# EAGLE design Breakout (EAGLE 7.6.0)
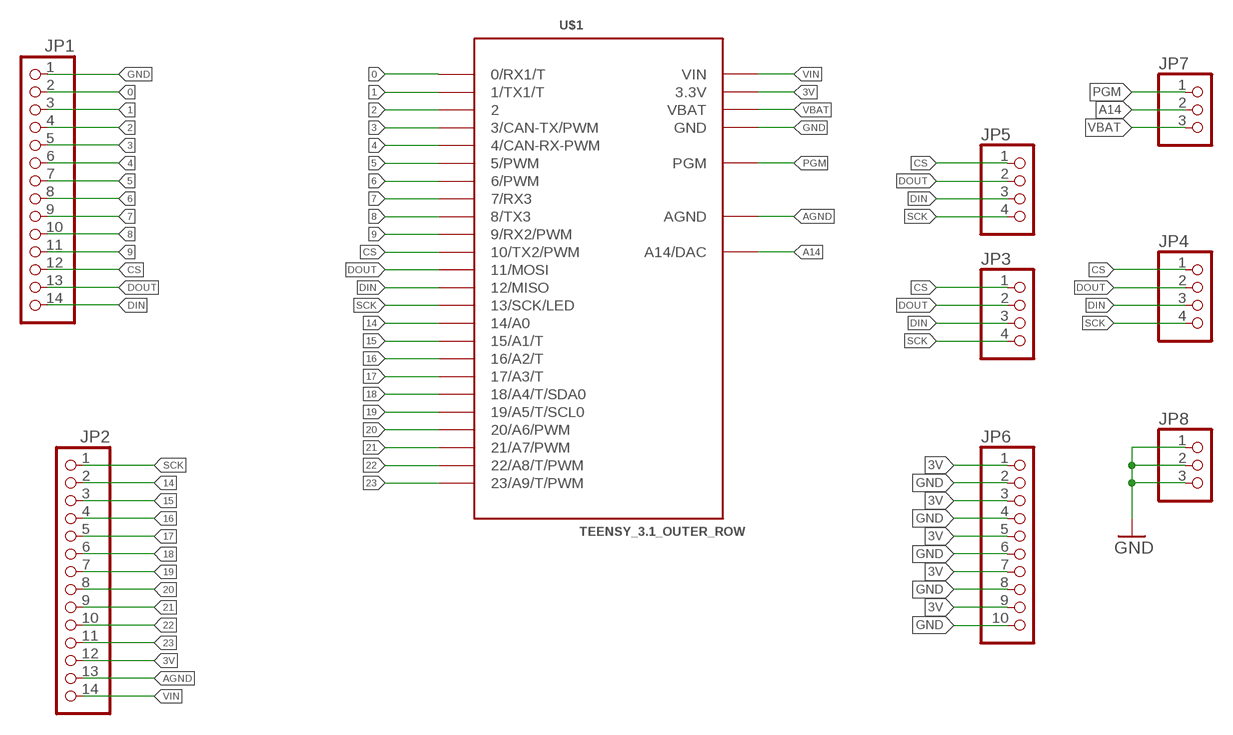
[diagram p0: schematic, sheet 1]

## Parts
JP1  PINHD-1X14  [1X14]
JP2  PINHD-1X14  [1X14]
JP3  PINHD-1X4  [1X04]
JP4  PINHD-1X4  [1X04]
JP5  PINHD-1X4  [1X04]
JP6  PINHD-1X10  [1X10]
JP7  PINHD-1X3  [1X03]
JP8  PINHD-1X3  [1X03]
U$1  TEENSY_3.1_OUTER_ROW  [TEENSY3-OUTER_ROW]

## Nets
0: JP1.2 U$1.0(0/RX1/T)
1: JP1.3 U$1.1(1/TX1/T)
2: JP1.4 U$1.2
3: JP1.5 U$1.3(3/CAN-TX/PWM)
3V: JP2.12 JP6.1 JP6.3 JP6.5 JP6.7 JP6.9 U$1.3.3V U$1.3.3V1(3.3V)
4: JP1.6 U$1.4(4/CAN-RX-PWM)
5: JP1.7 U$1.5(5/PWM)
6: JP1.8 U$1.6(6/PWM)
7: JP1.9 U$1.7(7/RX3)
8: JP1.10 U$1.8(8/TX3)
9: JP1.11 U$1.9(9/RX2/PWM)
14: JP2.2 U$1.14/A0
15: JP2.3 U$1.15/A1(15/A1/T)
16: JP2.4 U$1.16/A2(16/A2/T)
17: JP2.5 U$1.17/A3(17/A3/T)
18: JP2.6 U$1.18/A4(18/A4/T/SDA0)
19: JP2.7 U$1.19/A5(19/A5/T/SCL0)
20: JP2.8 U$1.20/A6(20/A6/PWM)
21: JP2.9 U$1.21/A7(21/A7/PWM)
22: JP2.10 U$1.22/A8(22/A8/T/PWM)
23: JP2.11 U$1.23/A9(23/A9/T/PWM)
A14: JP7.2 U$1.RESET/DAC(A14/DAC)
AGND: JP2.13 U$1.AGND
CS: JP1.12 JP3.1 JP4.1 JP5.1 U$1.10(10/TX2/PWM)
DIN: JP1.14 JP3.3 JP4.3 JP5.3 U$1.12(12/MISO)
DOUT: JP1.13 JP3.2 JP4.2 JP5.2 U$1.11(11/MOSI)
GND: JP1.1 JP6.2 JP6.4 JP6.6 JP6.8 JP6.10 JP8.1 JP8.2 JP8.3 U$1.GND U$1.GND1(GND)
PGM: JP7.1 U$1.PGM
SCK: JP2.1 JP3.4 JP4.4 JP5.4 U$1.13(13/SCK/LED)
VBAT: JP7.3 U$1.VBAT
VIN: JP2.14 U$1.VIN

## Library data of the parts
JP1 JP2 = pinhead:PINHD-1X14: PIN HEADER
JP3-JP5 = pinhead:PINHD-1X4: PIN HEADER
JP6 = pinhead:PINHD-1X10: PIN HEADER
JP7 JP8 = pinhead:PINHD-1X3: PIN HEADER
U$1 = Teensy_3_and_LC_Series_Boards_v1.1:TEENSY_3.1_OUTER_ROW: Footprint for Teensy 3.1 or 3.2 board using all pin connections on the outer perimeter

## Board
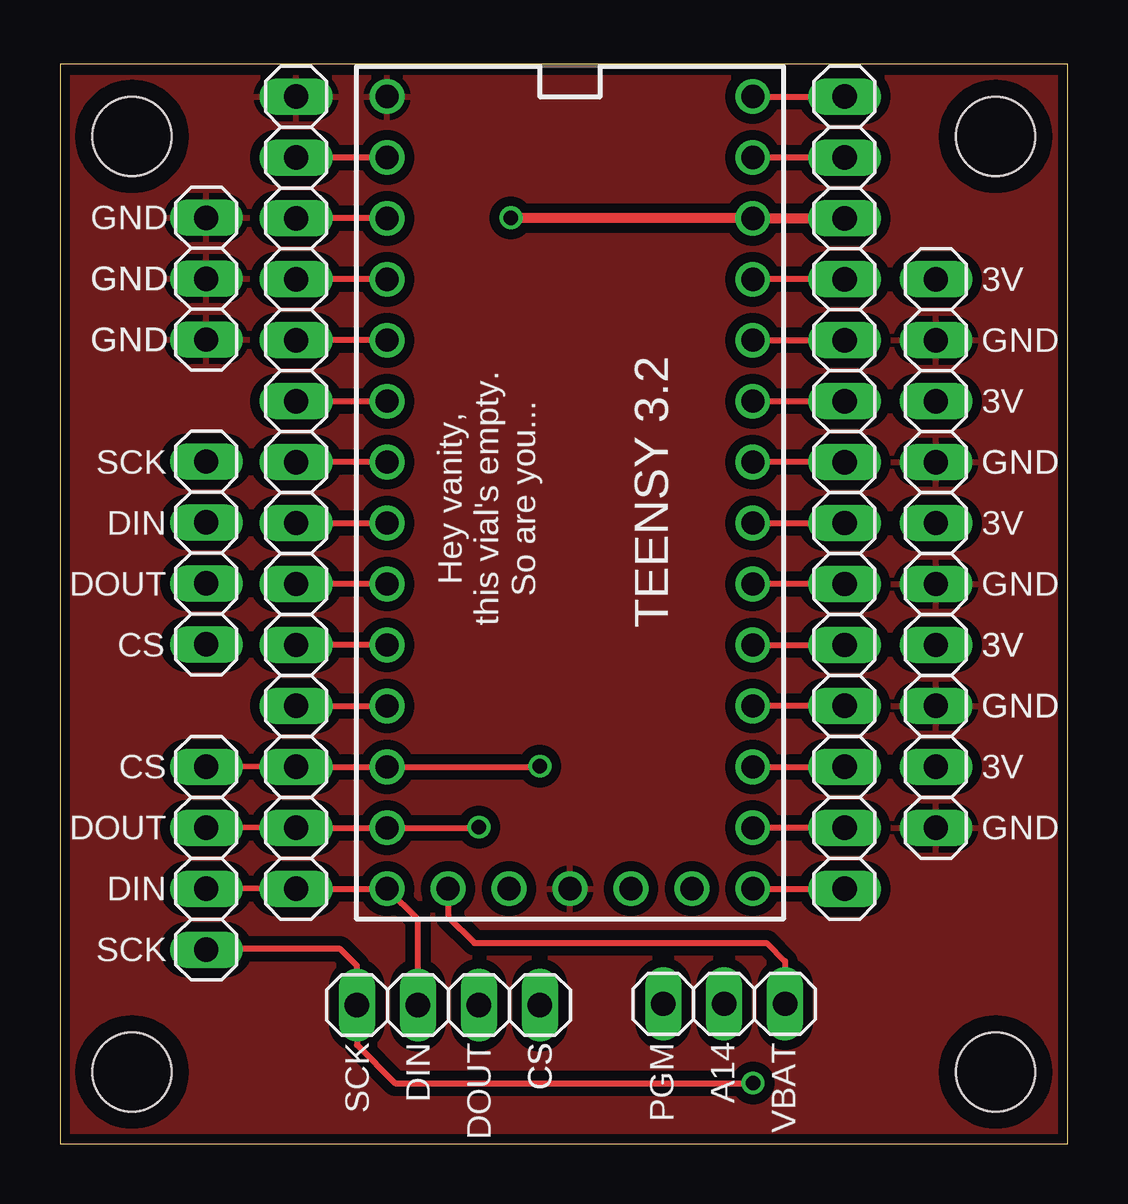
[diagram p1: board, top side]
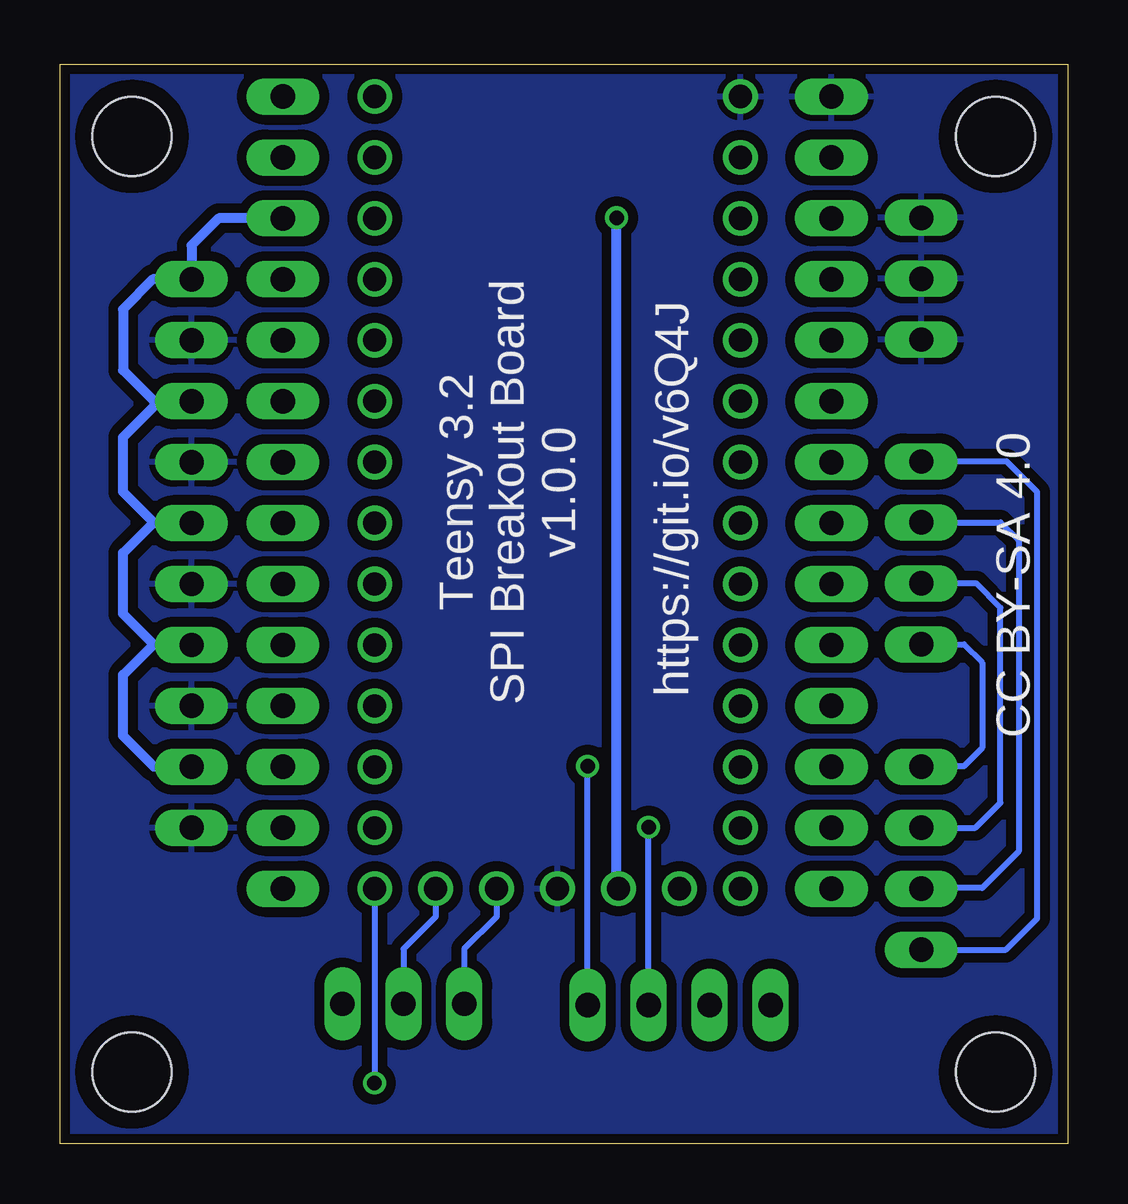
[diagram p2: board, bottom side, seen from below]

Size 42 x 45 mm. Coordinates in mm from the lower left corner, seen from the top.
Outline: 0,0 42,0 42,45 0,45 0,0
Copper layers (1*16): Top 0.0356mm / dielectric 1.5011mm / Bottom 0.0356mm
Design rules "LaenPCBOrder": minimum track width 6mil, minimum drill 13mil, track to track 6mil, track to pad 6mil, pad to pad 6mil, via to via 6mil, smd to smd 6mil, copper to edge 15mil, drill to drill 6mil, minimum pad ring 7mil, minimum via ring 7mil, stop-mask expansion 3mil, vias tented up to drill 0mil, thermal gap 10mil

### Footprints (pad centres in the part's own frame; a part is rotated, then mirrored left to right if it is on the bottom)
1X14 = drill 1.016 long: 1 -16.51,0; 2 -13.97,0; 3 -11.43,0; 4 -8.89,0; 5 -6.35,0; 6 -3.81,0; 7 -1.27,0; 8 1.27,0; 9 3.81,0; 10 6.35,0; 11 8.89,0; 12 11.43,0; 13 13.97,0; 14 16.51,0
1X04 = drill 1.016 long: 1 -3.81,0; 2 -1.27,0; 3 1.27,0; 4 3.81,0
1X10 = drill 1.016 long: 1 -11.43,0; 2 -8.89,0; 3 -6.35,0; 4 -3.81,0; 5 -1.27,0; 6 1.27,0; 7 3.81,0; 8 6.35,0; 9 8.89,0; 10 11.43,0
1X03 = drill 1.016 long: 1 -2.54,0; 2 0,0; 3 2.54,0
TEENSY3-OUTER_ROW = drill 0.965: 0 -7.62,13.97; 1 -7.62,11.43; 2 -7.62,8.89; 3 -7.62,6.35; 3.3V 7.62,11.43; 3.3V1 -2.54,-16.51; 4 -7.62,3.81; 5 -7.62,1.27; 6 -7.62,-1.27; 7 -7.62,-3.81; 8 -7.62,-6.35; 9 -7.62,-8.89; 10 -7.62,-11.43; 11 -7.62,-13.97; 12 -7.62,-16.51; 13 7.62,-16.51; 14/A0 7.62,-13.97; 15/A1 7.62,-11.43; 16/A2 7.62,-8.89; 17/A3 7.62,-6.35; 18/A4 7.62,-3.81; 19/A5 7.62,-1.27; 20/A6 7.62,1.27; 21/A7 7.62,3.81; 22/A8 7.62,6.35; 23/A9 7.62,8.89; AGND 7.62,13.97; GND -7.62,16.51; GND1 0,-16.51; PGM 2.54,-16.51; RESET/DAC 5.08,-16.51; VBAT -5.08,-16.51; VIN 7.62,16.51
STAND-OFF = hole 3.302: 0,0

### Placement (x,y rotation side)
JP1  9.84,27.15 270 top
JP2  32.7,27.15 90 top
JP3  6.1,11.91 270 top
JP4  6.1,24.64 90 top
JP5  16.19,5.79 180 top
JP6  36.51,24.61 270 top
JP7  27.69,5.84 0 top
JP8  6.1,36.07 90 top
U$1  21.26,27.15 0 top
U$2  [STAND-OFF]  3,42 0 top
U$3  [STAND-OFF]  39,42 0 top
U$4  [STAND-OFF]  39,3 0 top
U$5  [STAND-OFF]  3,3 0 top

### Tracks (layer width: path | path; a pad name or v marks a point on that pad's centre or on a via)
0
  Top 0.254: U$1.0 JP1.2
1
  Top 0.254: U$1.1 JP1.3
2
  Top 0.254: U$1.2 JP1.4
3
  Top 0.254: U$1.3 JP1.5
3V  (via drill 0.6)
  Top 0.406: JP2.12 U$1.3.3V 18.8,38.58 v18.8,38.61
  Bottom 0.406: JP2.12 35.38,38.59 36.51,37.47 JP6.1 38.12,36.04 39.37,34.8 39.37,32.26 38.1,30.99 37.85,30.99 | U$1.3.3V1 18.8,10.64 v18.8,38.61 | 37.85,30.99 36.54,30.99 JP6.3 | 37.85,30.99 39.37,29.46 39.37,27.18 38.08,25.88 JP6.5 36.54,25.91 38.1,25.91 39.37,24.64 39.37,22.1 38.08,20.8 JP6.7 36.54,20.83 38.1,20.83 39.37,19.56 39.37,17.02 38.08,15.72 JP6.9
4
  Top 0.254: JP1.6 U$1.4
5
  Top 0.254: U$1.5 JP1.7
6
  Top 0.254: JP1.8 U$1.6
7
  Top 0.254: U$1.7 JP1.9
8
  Top 0.254: U$1.8 JP1.10
9
  Top 0.254: JP1.11 U$1.9
14
  Top 0.254: JP2.2 U$1.14/A0
15
  Top 0.254: U$1.15/A1 JP2.3
16
  Top 0.254: JP2.4 U$1.16/A2
17
  Top 0.254: U$1.17/A3 JP2.5
18
  Top 0.254: JP2.6 U$1.18/A4
19
  Top 0.254: U$1.19/A5 JP2.7
20
  Top 0.254: JP2.8 U$1.20/A6
21
  Top 0.254: U$1.21/A7 JP2.9
22
  Top 0.254: U$1.22/A8 JP2.10
23
  Top 0.254: JP2.11 U$1.23/A9
A14
  Bottom 0.254: U$1.RESET/DAC 26.34,9.47 27.69,8.13 JP7.2
AGND
  Top 0.254: JP2.13 U$1.AGND
CS  (via drill 0.6)
  Top 0.254: JP3.1 6.11,15.73 JP1.12 U$1.10 19.98,15.72 v20,15.75
  Bottom 0.254: JP4.1 4.32,20.83 3.56,20.07 3.56,16.51 4.32,15.75 6.07,15.75 JP3.1 | JP5.1 v20,15.75
DIN
  Top 0.254: JP3.3 6.11,10.65 JP1.14 U$1.12 14.92,9.36 JP5.3
  Bottom 0.254: JP4.3 2.79,25.91 2.03,25.15 2.03,12.19 3.56,10.67 6.07,10.67 JP3.3
DOUT  (via drill 0.6)
  Top 0.254: JP3.2 6.11,13.19 JP1.13 U$1.11 17.44,13.18 v17.46,13.21
  Bottom 0.254: JP3.2 3.83,13.18 2.79,14.22 2.79,22.35 3.81,23.37 JP4.2 | JP5.2 v17.46,13.21
GND
  pour Top (isolate 0.406): 0,44.45 41.91,44.45 41.91,0 0,0
  pour Bottom (isolate 0.406): 0,44.96 41.91,44.96 41.91,0 0,0
PGM
  Bottom 0.254: U$1.PGM 23.8,9.47 25.15,8.13 JP7.1
SCK  (via drill 0.6)
  Top 0.254: U$1.13 JP2.1 | JP3.4 6.12,8.13 11.68,8.13 12.38,7.43 JP5.4 12.38,4.13 13.97,2.54 v28.89,2.54
  Bottom 0.254: JP3.4 2.56,8.1 1.27,9.4 1.27,27.18 2.54,28.45 JP4.4 | U$1.13 v28.89,2.54
VBAT
  Top 0.254: U$1.VBAT 16.18,9.47 17.27,8.38 29.46,8.38 30.23,7.62 JP7.3
VIN
  Top 0.254: U$1.VIN JP2.14

### Text on the board
tPlace: GND | GND | GND | 3V | GND | GND | GND | 3V | SCK | GND | GND | Hey vanity, / this vial's empty. / So are you... | TEENSY 3.2 | DIN | 3V | DOUT | GND | CS | 3V | 3V | GND | GND | CS | 3V | DOUT | GND | DIN | SCK | SCK | DIN | DOUT | CS | CS | PGM | A14 | VBAT
bPlace: https://git.io/v6Q4J | Teensy 3.2 / SPI Breakout Board / v1.0.0 | CC BY-SA 4.0